# Altium schematic sheet HyperRAM2.SchDoc: Shaheen PCB Board
size A3; Author: Mattia Sinigaglia; CompanyName: University of Bologna; DrawnBy: Mattia Sinigaglia; Organization: EES - Micrel Lab; Revision: v1; SheetNumber: 2; SheetTotal: 6
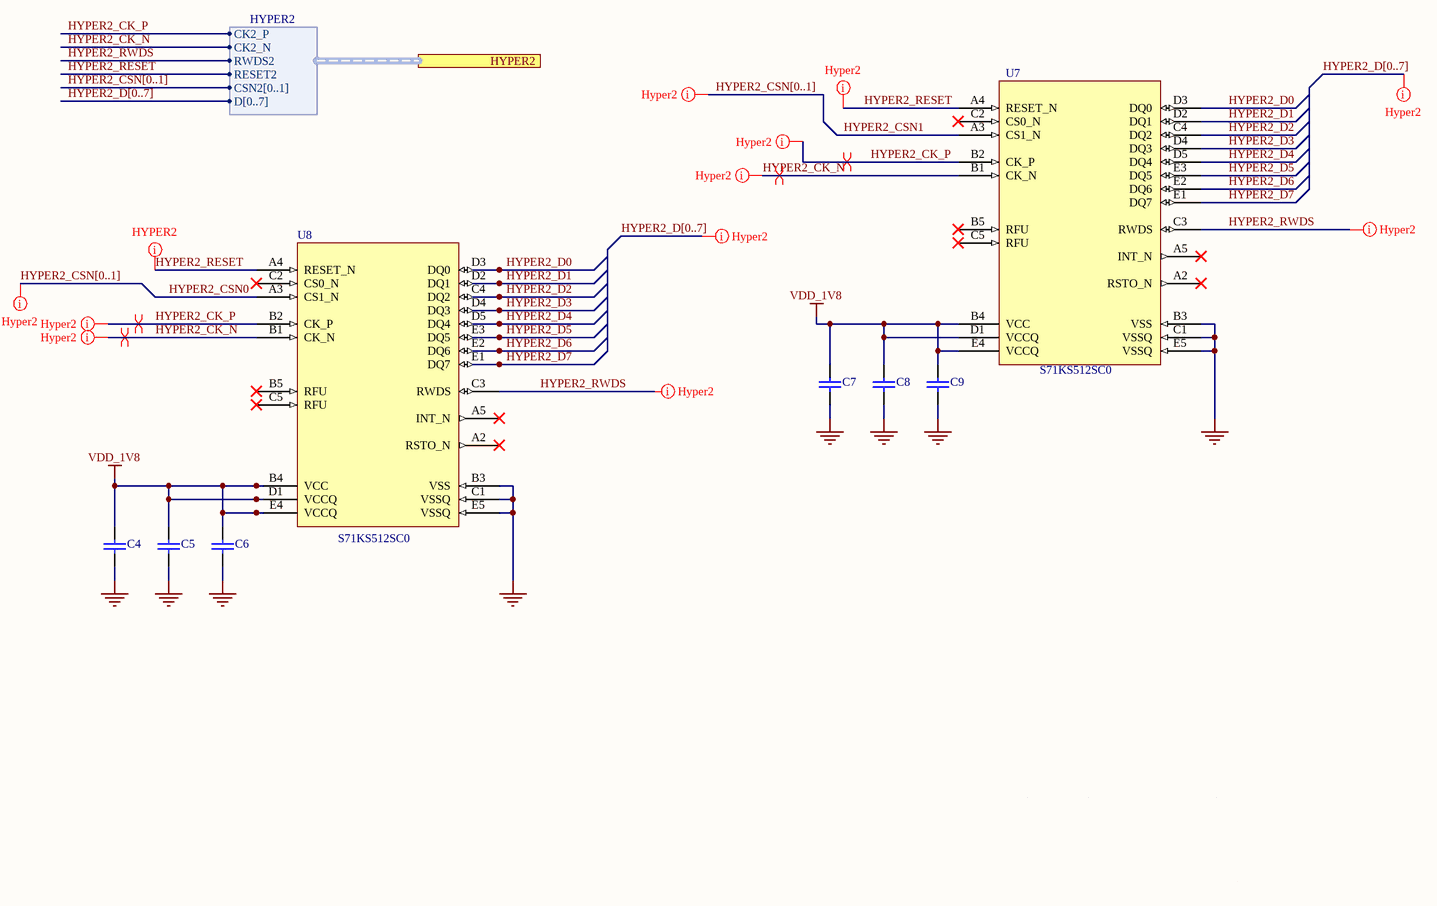
[diagram p0: HyperRAM2.SchDoc]

## Parts
C4  VJ0603Y104KNXAO  [CAPC1608X92X38LL15T08]  (value not drawn)
C5  VJ0603Y104KNXAO  [CAPC1608X92X38LL15T08]  (value not drawn)
C6  VJ0603Y104KNXAO  [CAPC1608X92X38LL15T08]  (value not drawn)
C7  VJ0603Y104KNXAO  [CAPC1608X92X38LL15T08]  (value not drawn)
C8  VJ0603Y104KNXAO  [CAPC1608X92X38LL15T08]  (value not drawn)
C9  VJ0603Y104KNXAO  [CAPC1608X92X38LL15T08]  (value not drawn)
U7  S71KS512SC0  [FBGA24_A-130]
U8  S71KS512SC0  [FBGA24_A-130]

## Ports
HYPER2 (harness HYPER2)

## Harnesses
HYPER2: D[0..7], CK2_P, CK2_N, RWDS2, CSN2[0..1], RESET2

## Nets
GND: C4.1 C5.1 C6.1 C7.1 C8.1 C9.1 U7.B3(VSS) U7.C1(VSSQ) U7.E5(VSSQ) U8.B3(VSS) U8.C1(VSSQ) U8.E5(VSSQ)
VDD_1V8: C4.2 C5.2 C6.2 C7.2 C8.2 C9.2 U7.B4(VCC) U7.D1(VCCQ) U7.E4(VCCQ) U8.B4(VCC) U8.D1(VCCQ) U8.E4(VCCQ)
HYPER2_CK_N: U7.B1(CK_N) U8.B1(CK_N) ; port HYPER2.CK2_N
HYPER2_CK_P: U7.B2(CK_P) U8.B2(CK_P) ; port HYPER2.CK2_P
HYPER2_CSN0: U8.A3(CS1_N)
HYPER2_CSN1: U7.A3(CS1_N)
HYPER2_D0: U7.D3(DQ0) U8.D3(DQ0)
HYPER2_D1: U7.D2(DQ1) U8.D2(DQ1)
HYPER2_D2: U7.C4(DQ2) U8.C4(DQ2)
HYPER2_D3: U7.D4(DQ3) U8.D4(DQ3)
HYPER2_D4: U7.D5(DQ4) U8.D5(DQ4)
HYPER2_D5: U7.E3(DQ5) U8.E3(DQ5)
HYPER2_D6: U7.E2(DQ6) U8.E2(DQ6)
HYPER2_D7: U7.E1(DQ7) U8.E1(DQ7)
HYPER2_RESET: U7.A4(RESET_N) U8.A4(RESET_N) ; port HYPER2.RESET2
HYPER2_RWDS: U7.C3(RWDS) U8.C3(RWDS) ; port HYPER2.RWDS2

Not connected (* = marked no-connect by the designer): U7 A2(RSTO_N)* A5(INT_N)* B5(RFU)* C2(CS0_N)* C5(RFU)*; U8 A2(RSTO_N)* A5(INT_N)* B5(RFU)* C2(CS0_N)* C5(RFU)*

## Buses and harness runs
bus HYPER2_CSN[0..1]
bus HYPER2_D[0..7]

## Layout directives
mark named HYPER2: HYPER2_RESET
net class Hyper2: (no net found under the mark), HYPER2_CK_N, HYPER2_CK_P, HYPER2_RESET, HYPER2_RWDS
differential pair: HYPER2_CK_N, HYPER2_CK_P

## Notes on the sheet
- 1
- 2
- 3
- 4
- 5
- 6
- 7
- 8
- A
- B
- C
- D
- Project:
- Date:
- Drawing number:
- Rev:
- Format:
- A3
- Drawn by:
- Laboratory:
- Page
- Sheet:
- of
- File:

## Library data of the parts
C4-C6 C8 C9 = CMP-1035-02588-2: Manufacturer: Vitramon; Part Number: VJ0603Y104KNXAO
C7 = CMP-1035-02588-2: 100nF; Manufacturer: Vitramon; Part Number: VJ0603Y104KNXAO